# EAGLE design UTX-2021F015 (EAGLE 9.6.2)
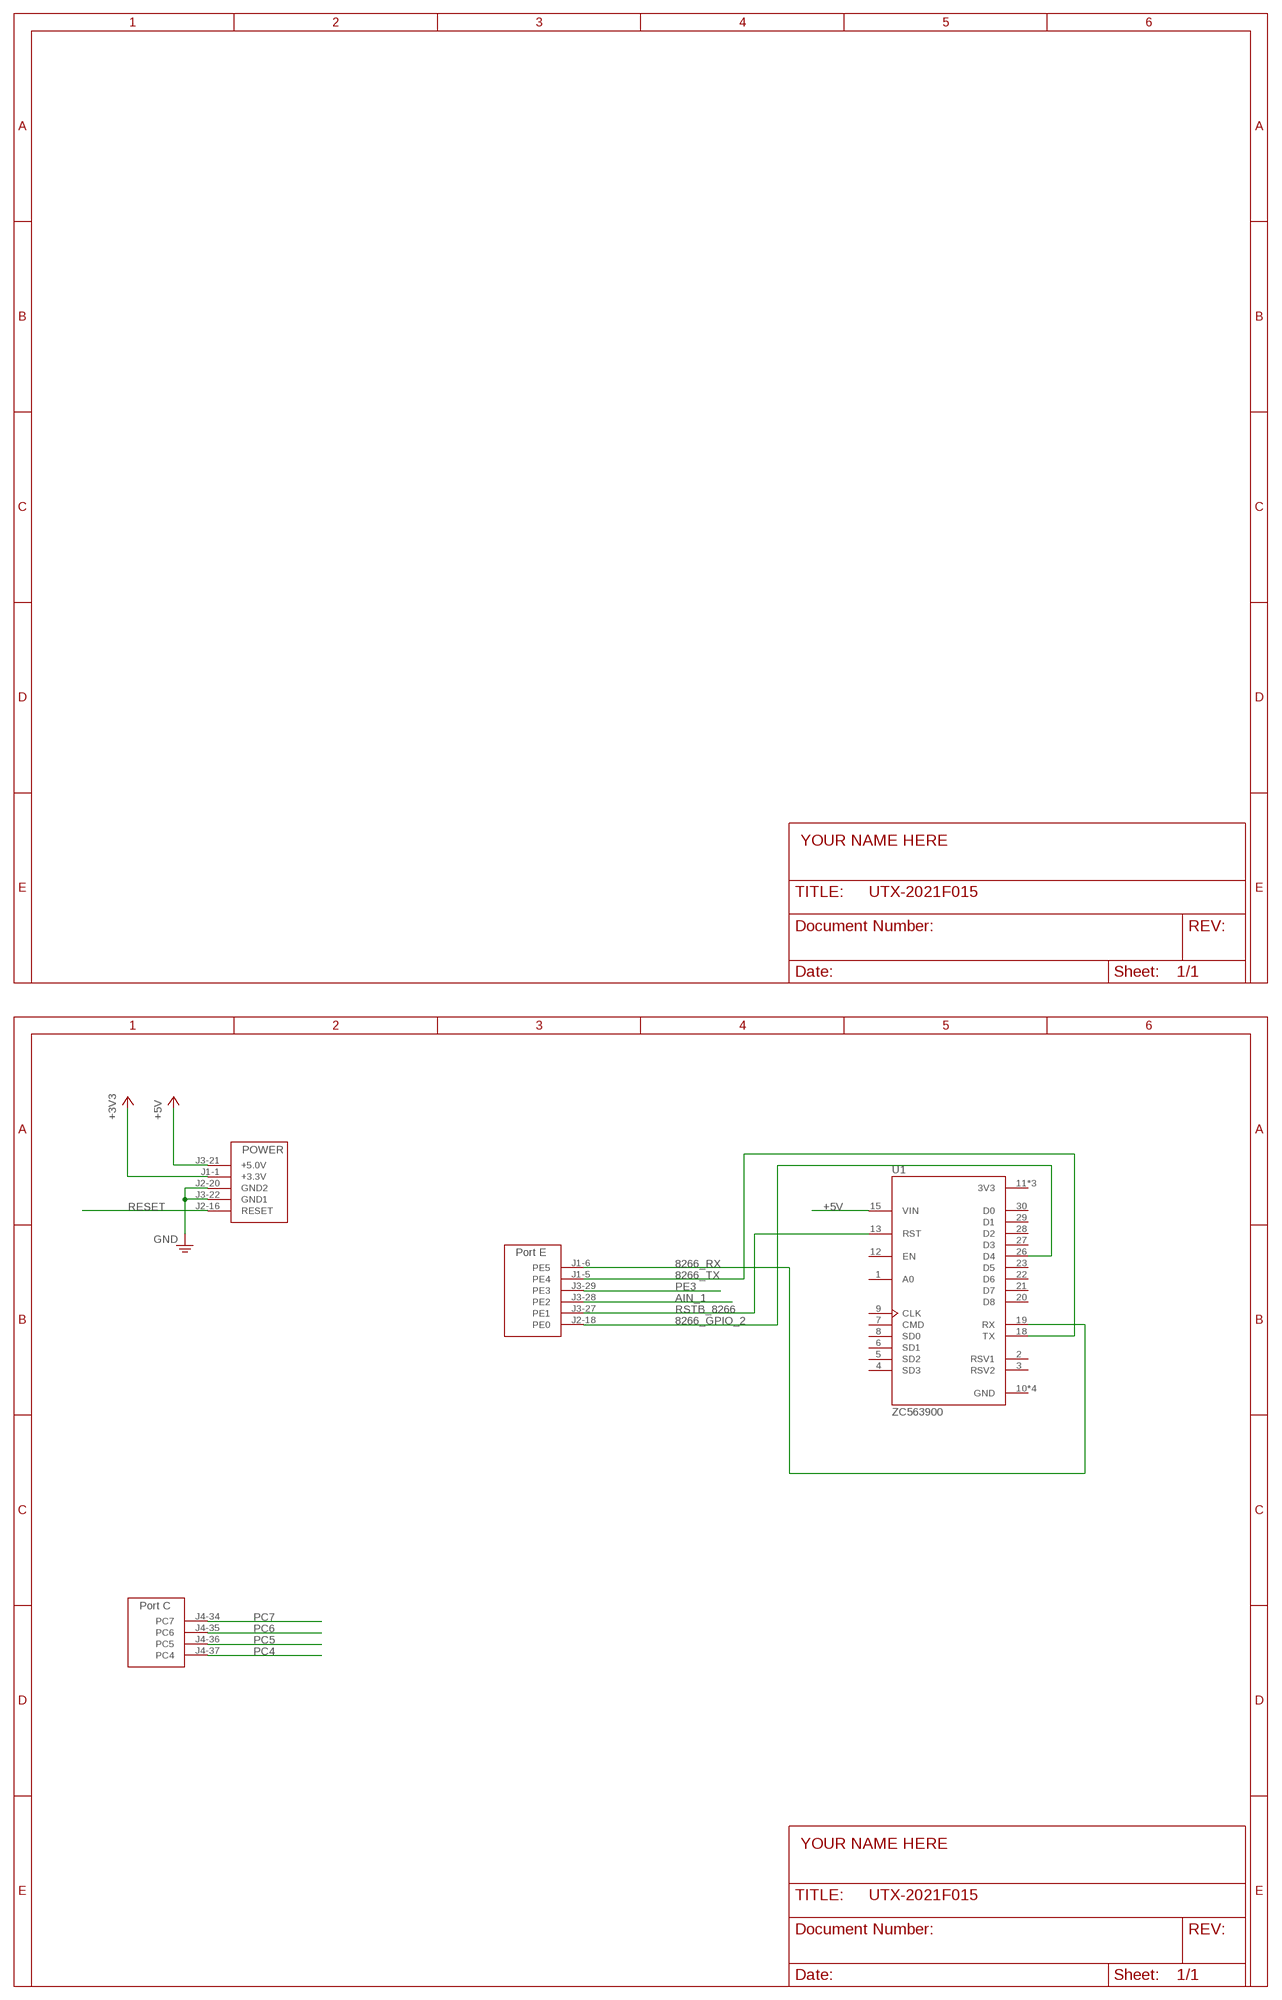
[diagram p0: schematic, sheet 1, part 1 of 2]
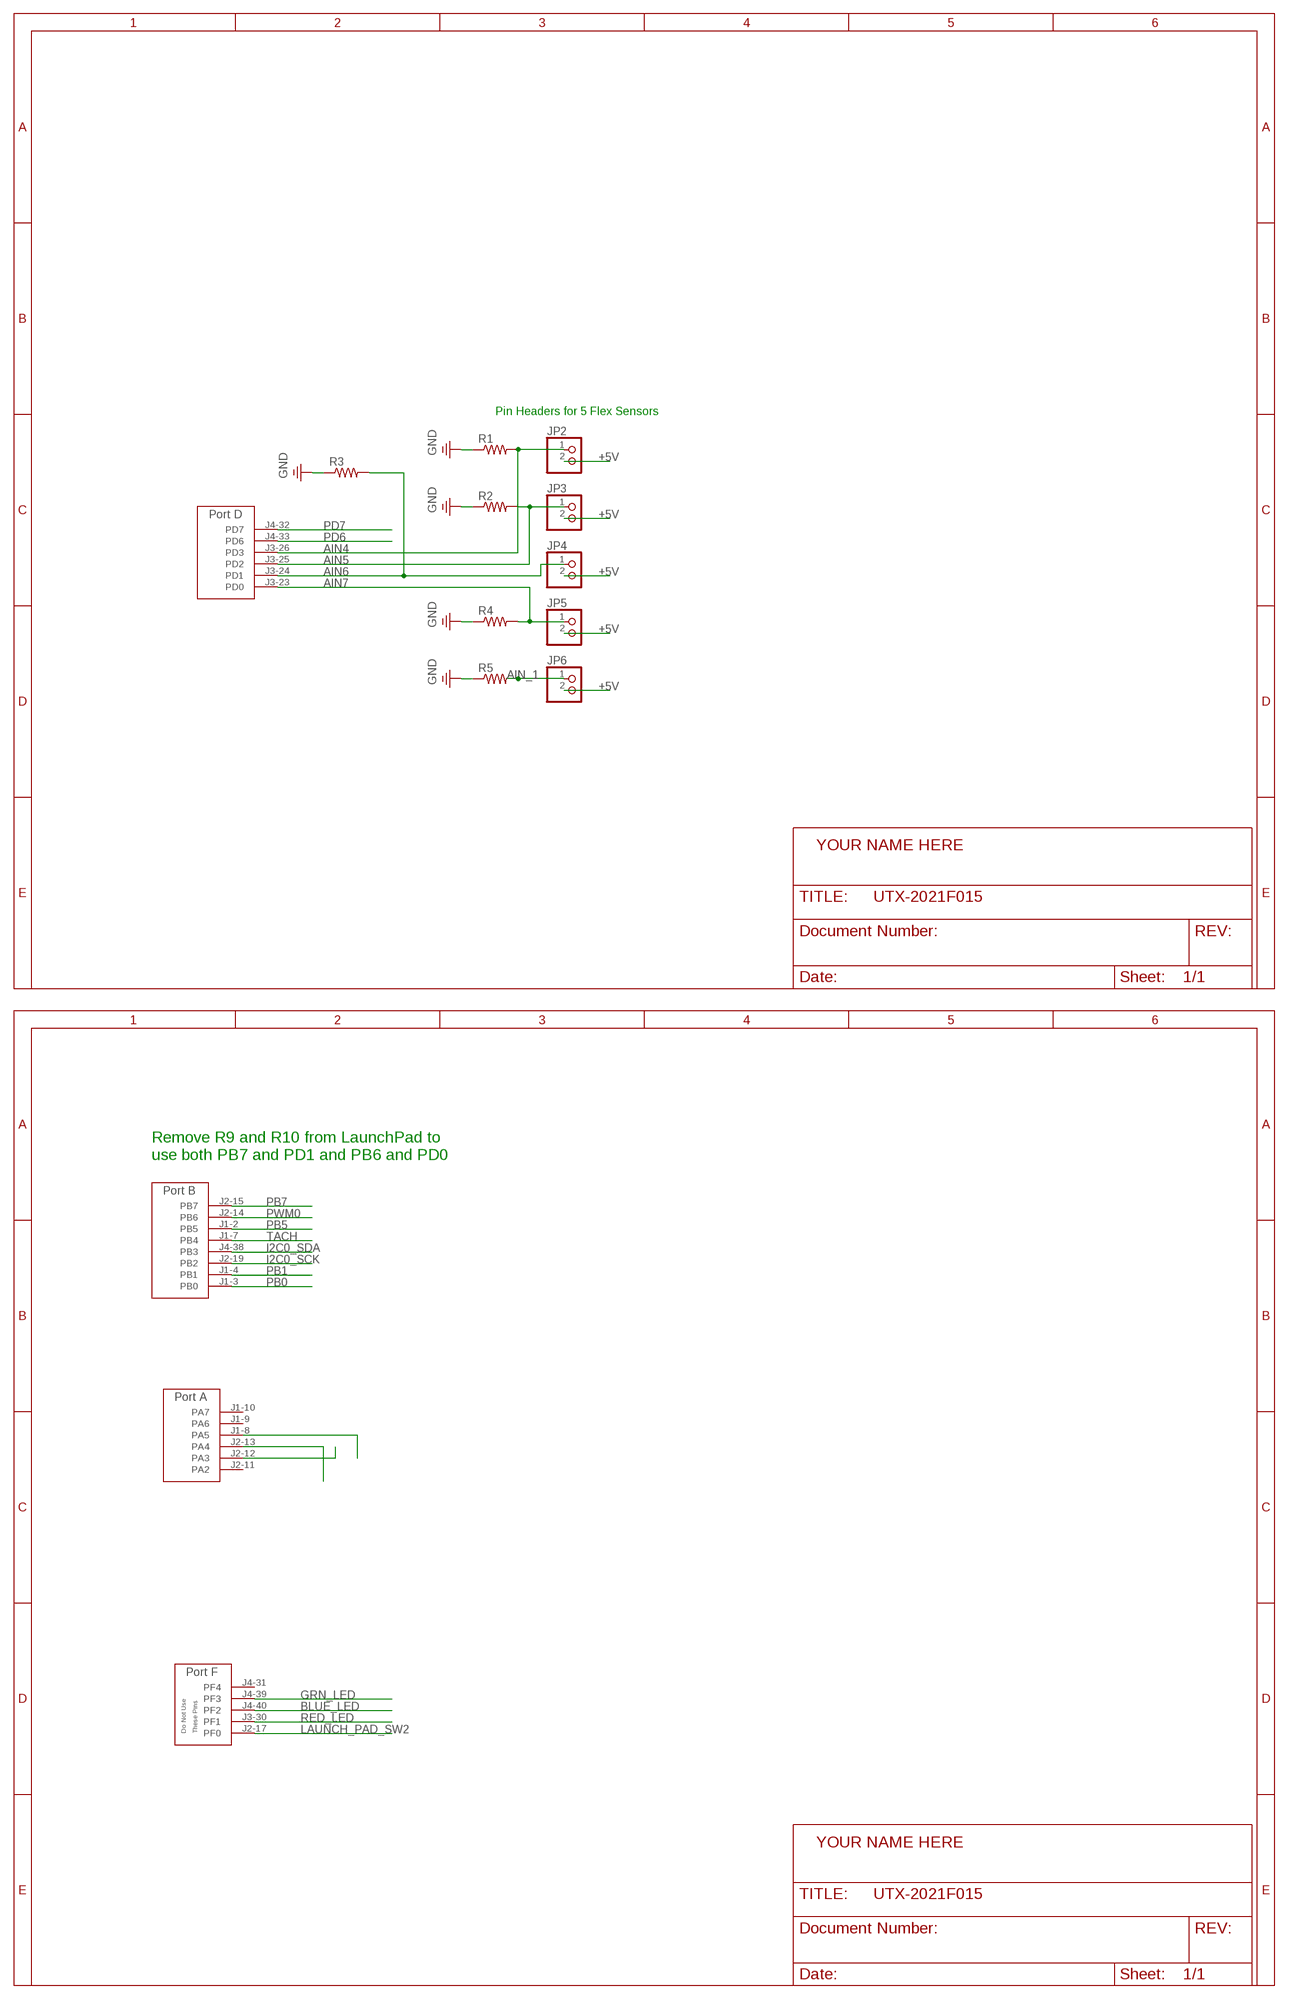
[diagram p1: schematic, sheet 1, part 2 of 2]

## Parts
JP2  PINHD-1X2  [1X02]
JP3  PINHD-1X2  [1X02]
JP4  PINHD-1X2  [1X02]
JP5  PINHD-1X2  [1X02]
JP6  PINHD-1X2  [1X02]
R1  RESISTOR0204/7  [RES300MIL]
R2  RESISTOR0204/7  [RES300MIL]
R3  RESISTOR0204/7  [RES300MIL]
R4  RESISTOR0204/7  [RES300MIL]
R5  RESISTOR0204/7  [RES300MIL]
U1  ZC563900  [MODULE_ZC563900]
U$2  TM4C_BP  [TM4C_BOOSTER_PACK]

## Nets
8266_GPIO_2: U1.26(D4) U$2.J2-18(PE0)
8266_RX: U1.19(RX) U$2.J1-6(PE5)
8266_TX: U1.18(TX) U$2.J1-5(PE4)
+3V3: U$2.J1-1(+3.3V)
+5V: JP2.2 JP3.2 JP4.2 JP5.2 JP6.2 U1.15(VIN) U$2.J3-21(+5.0V)
AIN4: JP2.1 R1.2 U$2.J3-26(PD3)
AIN5: JP3.1 R2.2 U$2.J3-25(PD2)
AIN6: JP4.1 R3.2 U$2.J3-24(PD1)
AIN7: JP5.1 R4.2 U$2.J3-23(PD0)
AIN_1: JP6.1 R5.2 U$2.J3-28(PE2)
BLUE_LED: U$2.J4-40(PF2)
GND: R1.1 R2.1 R3.1 R4.1 R5.1 U$2.J2-20(GND2) U$2.J3-22(GND1)
GRN_LED: U$2.J4-39(PF3)
I2C0_SCK: U$2.J2-19(PB2)
I2C0_SDA: U$2.J4-38(PB3)
LAUNCH_PAD_SW2: U$2.J2-17(PF0)
PB0: U$2.J1-3(PB0)
PB1: U$2.J1-4(PB1)
PB5: U$2.J1-2(PB5)
PB7: U$2.J2-15(PB7)
PC4: U$2.J4-37(PC4)
PC5: U$2.J4-36(PC5)
PC6: U$2.J4-35(PC6)
PC7: U$2.J4-34(PC7)
PD6: U$2.J4-33(PD6)
PD7: U$2.J4-32(PD7)
PE3: U$2.J3-29(PE3)
PWM0: U$2.J2-14(PB6)
RED_LED: U$2.J3-30(PF1)
RESET: U$2.J2-16(RESET)
RSTB_8266: U1.13(RST) U$2.J3-27(PE1)
ST7735_MISO: U$2.J2-13(PA4)
ST7735_MOSI: U$2.J1-8(PA5)
ST7735_TFT_CS: U$2.J2-12(PA3)
TACH: U$2.J1-7(PB4)
Unconnected: U1.1(A0) U1.2(RSV1) U1.3(RSV2) U1.4(SD3) U1.5(SD2) U1.6(SD1) U1.7(CMD) U1.8(SD0) U1.9(CLK) U1.12(EN) U1.20(D8) U1.21(D7) U1.22(D6) U1.23(D5) U1.27(D3) U1.28(D2) U1.29(D1) U1.30(D0) U$2.J1-9(PA6) U$2.J1-10(PA7) U$2.J2-11(PA2) U$2.J4-31(PF4)

## Notes on the sheet
- Pin Headers for 5 Flex Sensors
- YOUR NAME HERE | YOUR NAME HERE
- Remove R9 and R10 from LaunchPad to
  use both PB7 and PD1 and PB6 and PD0
- YOUR NAME HERE
- YOUR NAME HERE

## Power pins joined to a net without a drawn wire
3V3: U1.11(3V3) U1.16(3V3) U1.25(3V3)
GND: U1.10(GND) U1.14(GND) U1.17(GND) U1.24(GND)

## Library data of the parts
JP2-JP6 = pinhead:PINHD-1X2: PIN HEADER
R1-R5 = EE445L:RESISTOR: RESISTOR, American symbol
U1 = ZC563900:ZC563900: NodeMcu Lua ESP8266 WIFI Internet of Things Network Development Module Board Check prices <https://pricing.snapeda.com/parts/ZC563900/YKS/view-part?ref=eda>; AVAILABILITY: Not in stock; DESCRIPTION: NodeMcu Lua ESP8266 WIFI Internet of Things Network Development Module Board; MF: YKS; MP: ZC563900; PACKAGE: None; PRICE: None
U$2 = EE445L:TM4C_BP

## Board
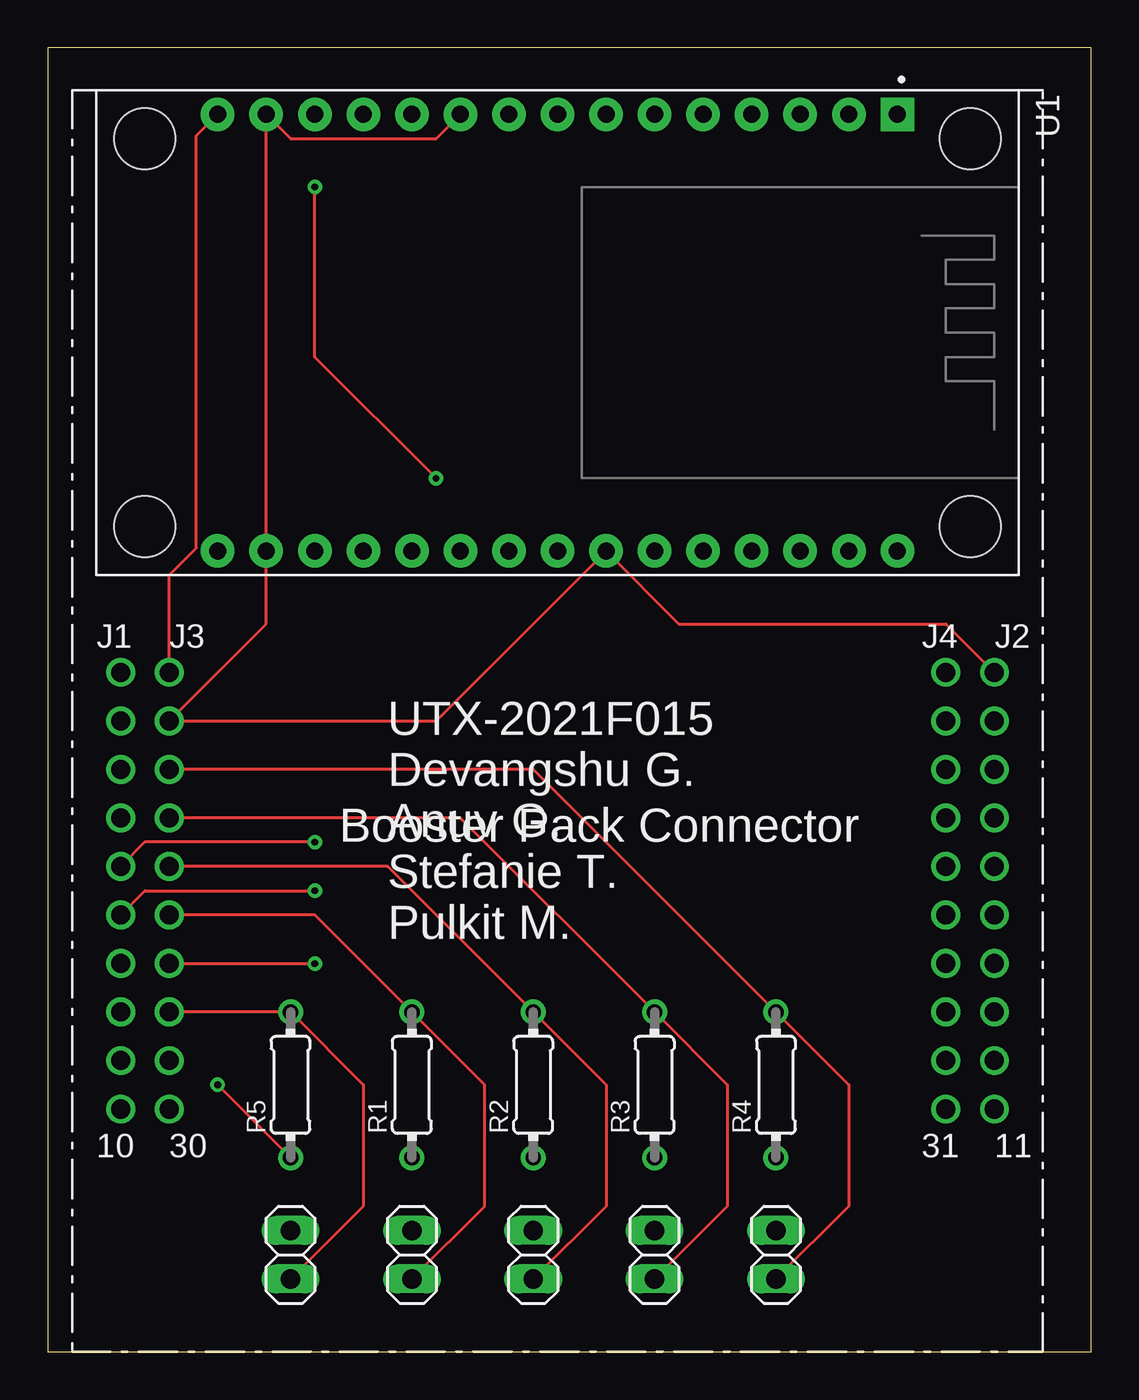
[diagram p2: board, top side]
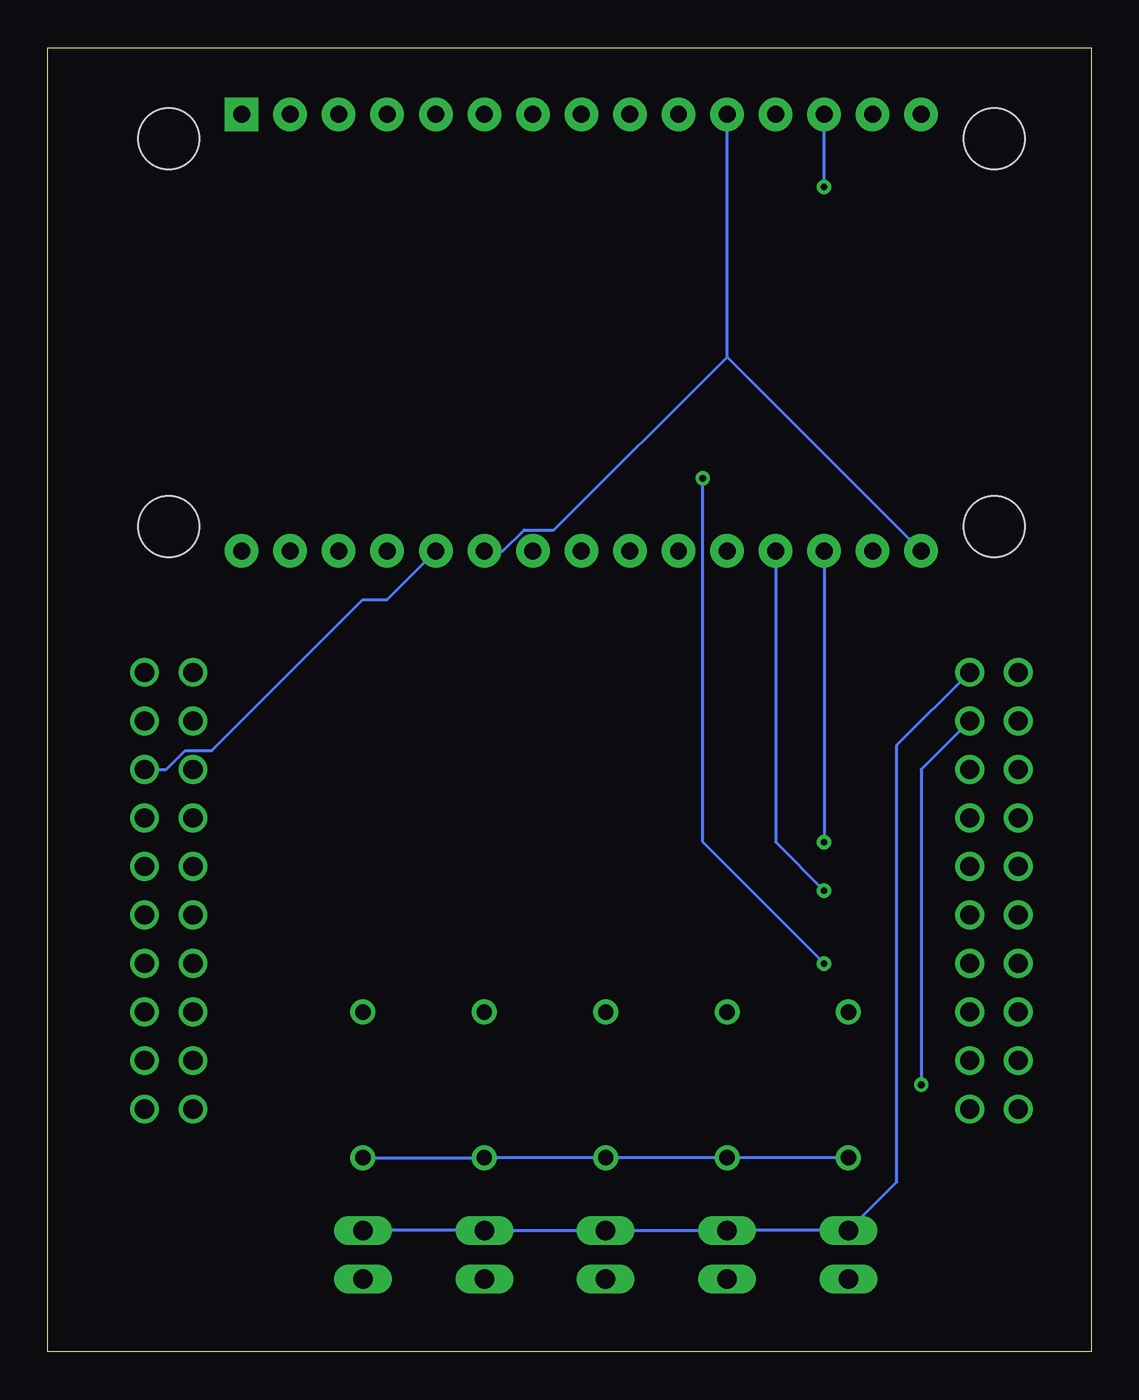
[diagram p3: board, bottom side, seen from below]

Size 54.59 x 68.25 mm. Coordinates in mm from the lower left corner, seen from the top.
Outline: 0,0 54.59,0 54.59,68.25 0,68.25 0,0
Copper layers (1*16): Top 0.035mm / dielectric 1.5mm / Bottom 0.035mm
Design rules "default": minimum track width 6mil, minimum drill 0.35mm, track to track 6mil, track to pad 6mil, pad to pad 6mil, via to via 6mil, smd to smd 6mil, copper to edge 40mil, drill to drill 6mil, minimum pad ring 10mil, minimum via ring 8mil, stop-mask expansion 4mil, vias tented up to drill 0mil, thermal gap 10mil

### Footprints (pad centres in the part's own frame; a part is rotated, then mirrored left to right if it is on the bottom)
1X02 = drill 1.016 long: 1 -1.27,0; 2 1.27,0
RES300MIL = drill 0.8: 1 -3.81,0; 2 3.81,0
MODULE_ZC563900 = drill 0.889 pad 1.753 square: 1 -11.43,17.78 | drill 0.889 pad 1.753: 2 -11.43,15.24; 3 -11.43,12.7; 4 -11.43,10.16; 5 -11.43,7.62; 6 -11.43,5.08; 7 -11.43,2.54; 8 -11.43,0; 9 -11.43,-2.54; 10 -11.43,-5.08; 11 -11.43,-7.62; 12 -11.43,-10.16; 13 -11.43,-12.7; 14 -11.43,-15.24; 15 -11.43,-17.78; 16 11.43,-17.78; 17 11.43,-15.24; 18 11.43,-12.7; 19 11.43,-10.16; 20 11.43,-7.62; 21 11.43,-5.08; 22 11.43,-2.54; 23 11.43,0; 24 11.43,2.54; 25 11.43,5.08; 26 11.43,7.62; 27 11.43,10.16; 28 11.43,12.7; 29 11.43,15.24; 30 11.43,17.78 | hole 3.2: -10.16,21.59; 10.16,21.59; 10.16,-21.59; -10.16,-21.59
TM4C_BOOSTER_PACK = drill 1: J1-1 0,22.86; J1-2 0,20.32; J1-3 0,17.78; J1-4 0,15.24; J1-5 0,12.7; J1-6 0,10.16; J1-7 0,7.62; J1-8 0,5.08; J1-9 0,2.54; J1-10 0,0; J2-11 45.72,0; J2-12 45.72,2.54; J2-13 45.72,5.08; J2-14 45.72,7.62; J2-15 45.72,10.16; J2-16 45.72,12.7; J2-17 45.72,15.24; J2-18 45.72,17.78; J2-19 45.72,20.32; J2-20 45.72,22.86; J3-21 2.54,22.86; J3-22 2.54,20.32; J3-23 2.54,17.78; J3-24 2.54,15.24; J3-25 2.54,12.7; J3-26 2.54,10.16; J3-27 2.54,7.62; J3-28 2.54,5.08; J3-29 2.54,2.54; J3-30 2.54,0; J4-31 43.18,0; J4-32 43.18,2.54; J4-33 43.18,5.08; J4-34 43.18,7.62; J4-35 43.18,10.16; J4-36 43.18,12.7; J4-37 43.18,15.24; J4-38 43.18,17.78; J4-39 43.18,20.32; J4-40 43.18,22.86

### Placement (x,y rotation side)
JP2  19.05,5.08 90 top
JP3  25.4,5.08 90 top
JP4  31.75,5.08 90 top
JP5  38.1,5.08 90 top
JP6  12.7,5.08 90 top
R1  19.05,13.97 90 top
R2  25.4,13.97 90 top
R3  31.75,13.97 90 top
R4  38.1,13.97 90 top
R5  12.7,13.97 90 top
U1  26.67,53.34 270 top
U$2  3.81,12.7 0 top

### Tracks (layer width: path | path; a pad name or v marks a point on that pad's centre or on a via)
3V3
  Bottom 0.152: U1.16 19.05,52.07 | 19.05,52.07 U1.11 | U1.25 30.77,41.91 29.67,43.02 28.11,43.02 19.05,52.07
8266_GPIO_2
  Bottom 0.152: U$2.J2-18 48.38,30.48 47.4,31.46 46.01,31.46 38.1,39.37 36.83,39.37 U1.26
8266_RX  (via drill 0.35)
  Top 0.152: v13.97,24.13 5.08,24.13 U$2.J1-6
  Bottom 0.152: U1.19 16.51,26.67 v13.97,24.13
8266_TX  (via drill 0.35)
  Top 0.152: v13.97,26.67 5.08,26.67 U$2.J1-5
  Bottom 0.152: U1.18 v13.97,26.67
+5V
  Top 0.152: U$2.J3-21 6.35,40.64 7.77,42.06 7.77,63.65 U1.15
  Bottom 0.152: U$2.J3-21 10.16,31.75 10.16,8.89 JP6.2 JP2.2 JP3.2 JP4.2 JP5.2
AIN4
  Top 0.152: JP2.1 22.86,7.62 22.86,13.97 R1.2 13.97,22.86 U$2.J3-26
AIN5
  Top 0.152: JP3.1 29.21,7.62 29.21,13.97 R2.2 17.78,25.4 U$2.J3-25
AIN6
  Top 0.152: JP4.1 35.56,7.62 35.56,13.97 R3.2 21.59,27.94 U$2.J3-24
AIN7
  Top 0.152: JP5.1 41.91,7.62 41.91,13.97 R4.2 25.4,30.48 U$2.J3-23
AIN_1
  Top 0.152: JP6.1 16.51,7.62 16.51,13.97 R5.2 U$2.J3-28
GND  (via drill 0.35)
  Top 0.152: v8.89,13.97 R5.1 | U1.10 20.32,63.5 12.7,63.5 U1.14 U1.17 11.43,38.1 U$2.J3-22 20.32,33.02 U1.24 33.02,38.1 46.99,38.1 U$2.J2-20
  Bottom 0.152: R4.1 R3.1 R2.1 R1.1 R5.1 | U$2.J3-22 8.89,30.48 v8.89,13.97
RSTB_8266  (via drill 0.35)
  Top 0.152: U$2.J3-27 v13.97,20.32 | v20.32,45.72 13.97,52.07 v13.97,60.96
  Bottom 0.152: v13.97,20.32 20.32,26.67 v20.32,45.72 | v13.97,60.96 U1.13

### Text on the board
tNames: UTX-2021F015 / Devangshu G. / Anuv G. / Stefanie T. / Pulkit M.